# EAGLE design Athena-r0p1 (EAGLE 9.6.2)

## Sheet 1 of 5
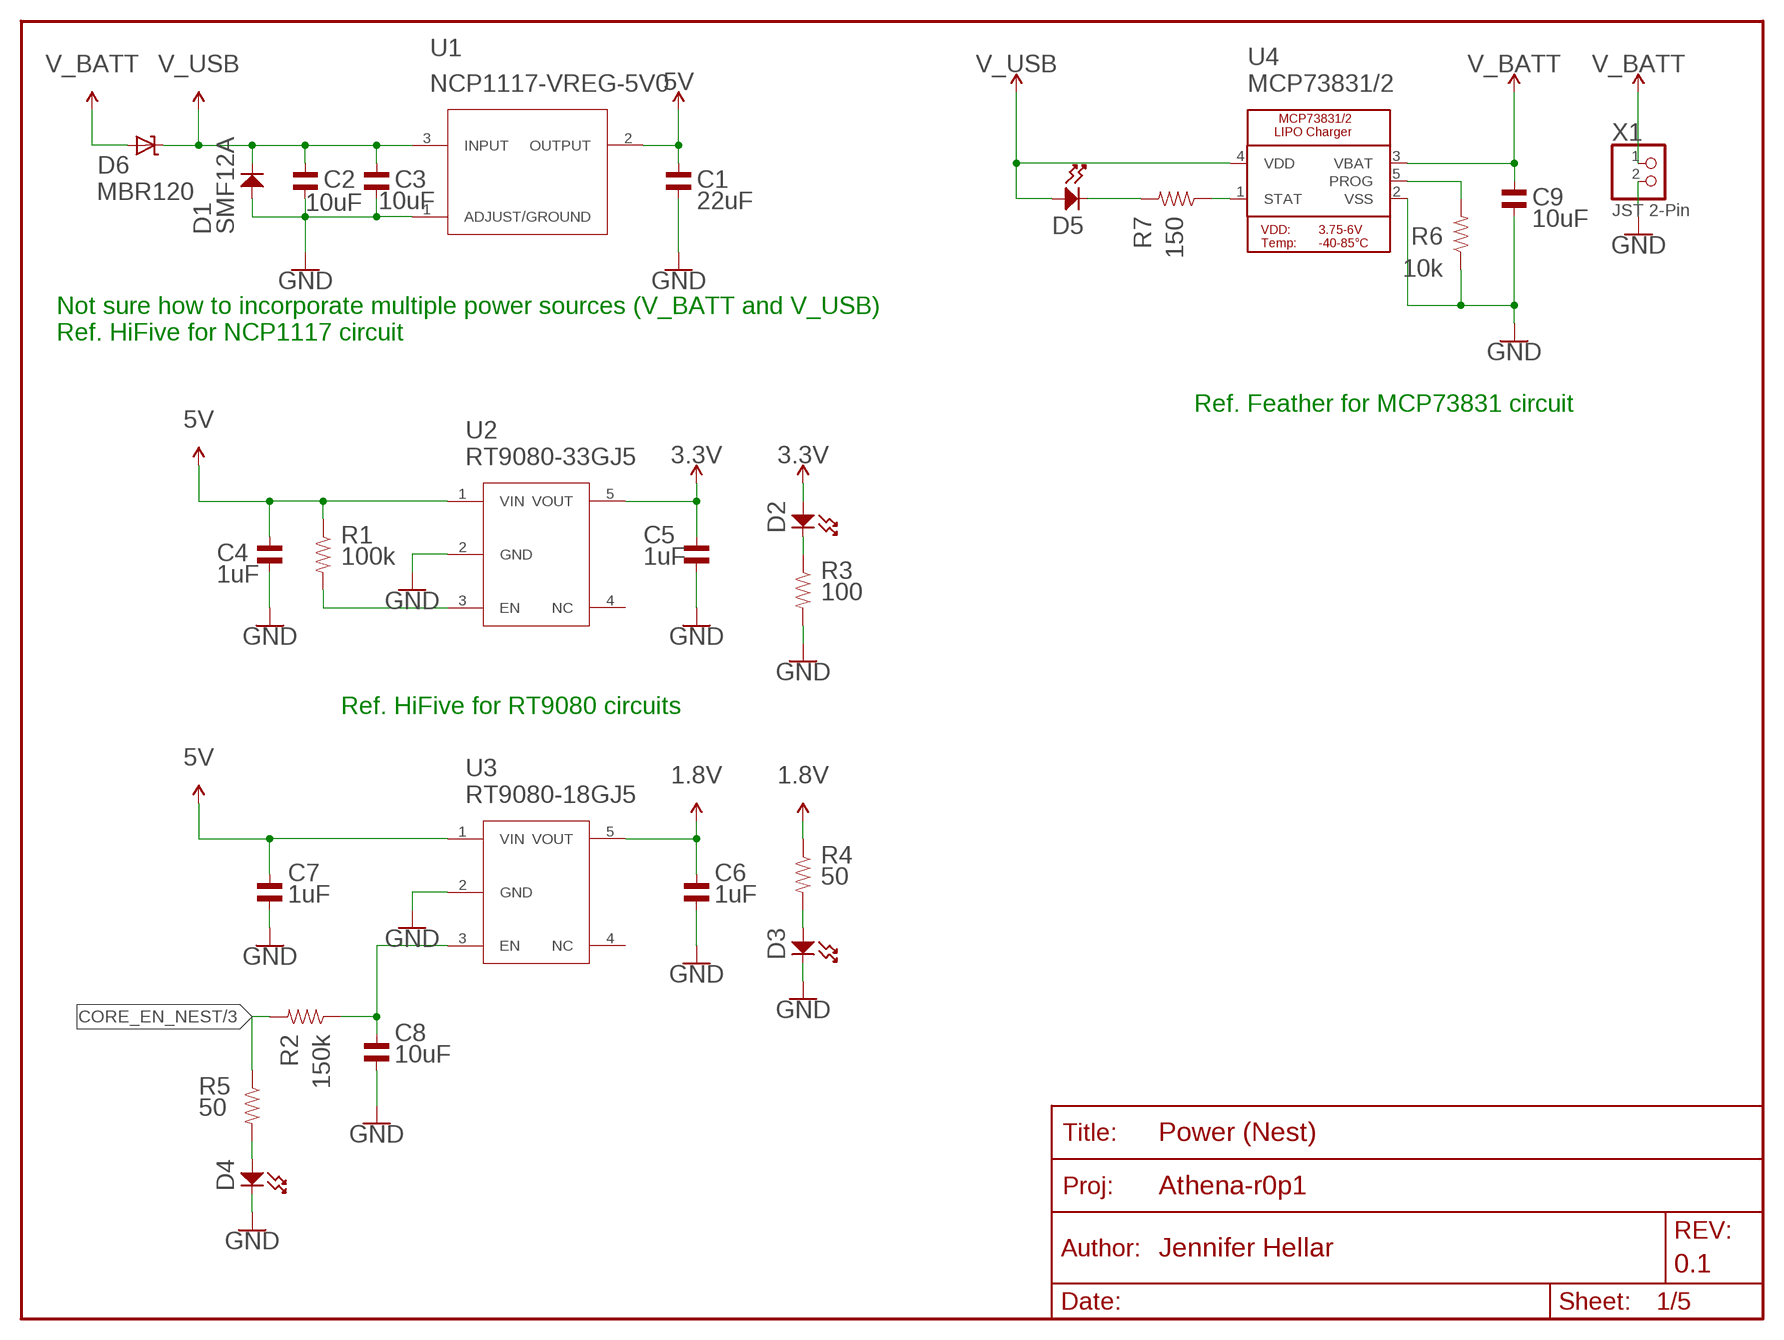
[diagram p0: schematic, sheet 1]

### Parts
C1  22uF  CAPACITOR_NP_0603  [C0603]
C2  10uF  CAPACITOR_NP_0603  [C0603]
C3  10uF  CAPACITOR_NP_0603  [C0603]
C4  1uF  CAPACITOR_NP_0603  [C0603]
C5  1uF  CAPACITOR_NP_0603  [C0603]
C6  1uF  CAPACITOR_NP_0603  [C0603]
C7  1uF  CAPACITOR_NP_0603  [C0603]
C8  10uF  CAPACITOR_NP_0603  [C0603]
C9  10uF  CAPACITOR_NP_0603  [C0603]
D1  SMF12A  [SMFSERIES_LTF]
D2  MF-LED-0603-GREEN  LED_SINGLE-0603-GREEN  [LED0603]
D3  MF-LED-0603-GREEN  LED_SINGLE-0603-GREEN  [LED0603]
D4  MF-LED-0603-GREEN  LED_SINGLE-0603-GREEN  [LED0603]
D5  MF-LED-0603-RED  LED_SINGLE-0603-RED  [LED0603]
D6  MBR120  DIODE-SCHOTTKYSOD-123  [SOD-123]
FRAME1  FRAME-LETTER  [SPARKFUN-AESTHETICS_CREATIVE_COMMONS]
R1  100k  RESISTOR_0603  [R0603]
R2  150k  RESISTOR_0603  [R0603]
R3  100  RESISTOR_0603  [R0603]
R4  50  RESISTOR_0603  [R0603]
R5  50  RESISTOR_0603  [R0603]
R6  10k  RESISTOR_0603  [R0603]
R7  150  RESISTOR_0603  [R0603]
U1  NCP1117-VREG-5V0  NCP1117LPST50T3G  [SOT223-3_ONS]
U2  RT9080-33GJ5  [TSOT23-5_ONS]
U3  RT9080-18GJ5  [TSOT23-5_ONS]
U4  MCP73831/2  IC_POWER_LIPO_MCP73831/2  [SOT23-5]
X1  JST 2-Pin  CONNECTORS_BATT_JST_PH_2PIN  [JSTPH2]

### Nets
1.8V: C6.P$1 R4.P$1 U3.5(VOUT) ; also sheet 3,4
3.3V: C5.P$1 D2.ANODE U2.5(VOUT) ; also sheet 2,3,4,5
5V: C1.P$1 C4.P$1 C7.P$1 R1.P$1 U1.2(OUTPUT) U2.1(VIN) U3.1(VIN) ; also sheet 2,3,5
CORE_EN_NEST: R2.P$2 R5.P$1 ; also sheet 3
GND: C1.P$2 C2.P$2 C3.P$2 C4.P$2 C5.P$2 C6.P$2 C7.P$2 C8.P$2 C9.P$2 D1.2(ANODE) D3.CATHODE D4.CATHODE R3.P$2 R6.P$1 U1.1(ADJUST/GROUND) U2.2(GND) U3.2(GND) U4.2(VSS) X1.2 ; also sheet 2,3,4,5
N$1: D3.ANODE R4.P$2
N$2: D2.CATHODE R3.P$1
N$3: R1.P$2 U2.3(EN)
N$4: C8.P$1 R2.P$1 U3.3(EN)
N$5: D4.ANODE R5.P$2
N$6: R7.P$1 U4.1(STAT)
N$7: R6.P$2 U4.5(PROG)
N$8: D5.CATHODE R7.P$2
V_BATT: C9.P$1 D6.A U4.3(VBAT) X1.1
V_USB: C2.P$1 C3.P$1 D1.1(CATHODE) D5.ANODE D6.C U1.3(INPUT) U4.4(VDD) ; also sheet 2
Unconnected: U2.4(NC) U3.4(NC)

### Notes on the sheet
- Not sure how to incorporate multiple power sources (V_BATT and V_USB)
  Ref. HiFive for NCP1117 circuit
- Ref. Feather for MCP73831 circuit
- Ref. HiFive for RT9080 circuits

## Sheet 2 of 5
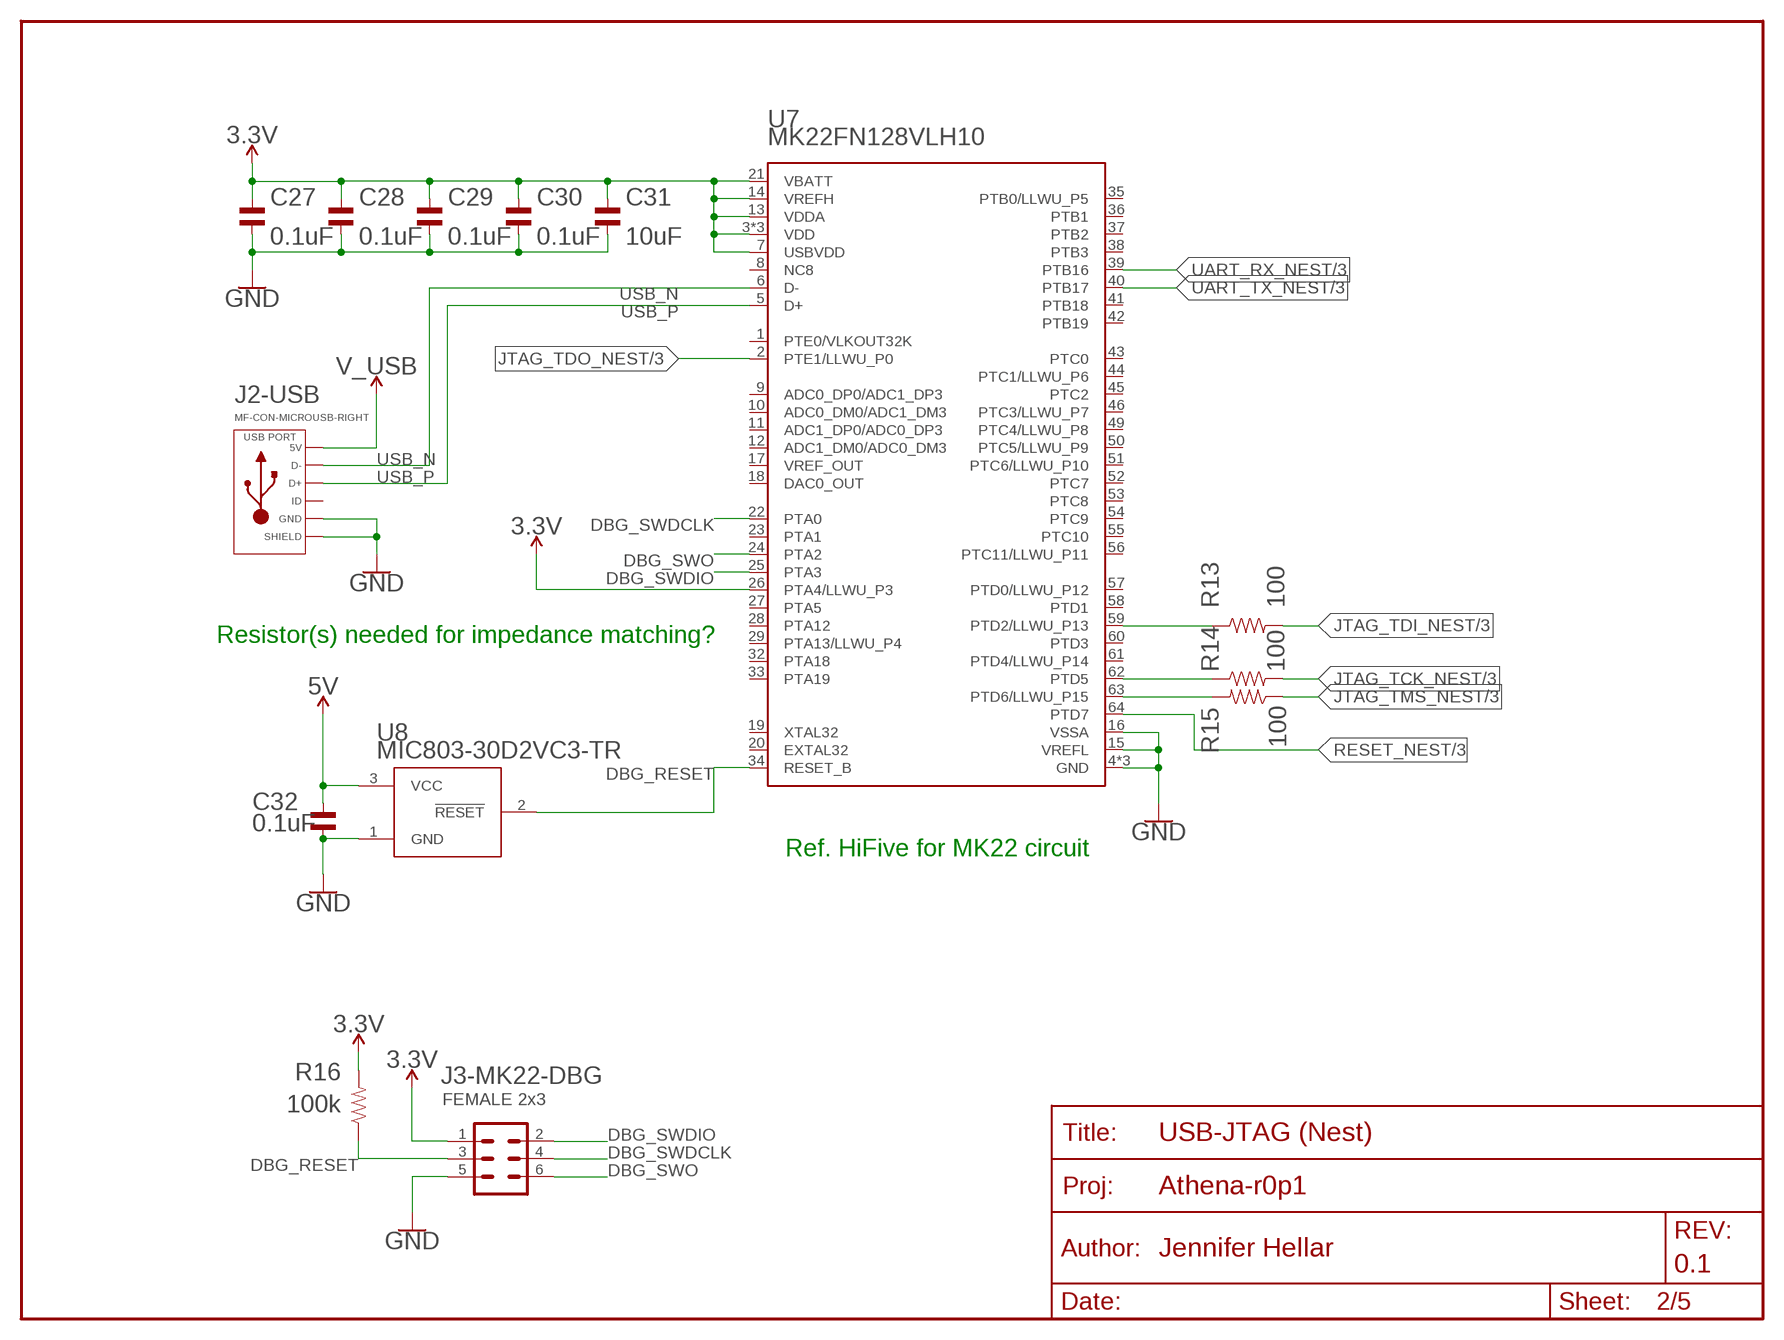
[diagram p1: schematic, sheet 2]

### Parts
C27  0.1uF  CAPACITOR_NP_0603  [C0603]
C28  0.1uF  CAPACITOR_NP_0603  [C0603]
C29  0.1uF  CAPACITOR_NP_0603  [C0603]
C30  0.1uF  CAPACITOR_NP_0603  [C0603]
C31  10uF  CAPACITOR_NP_0603  [C0603]
C32  0.1uF  CAPACITOR_NP_0603  [C0603]
FRAME3  FRAME-LETTER  [SPARKFUN-AESTHETICS_CREATIVE_COMMONS]
J2-USB  MF-CON-MICROUSB-RIGHT  USB_MICRO_RIGHT  [MICROUSB-RIGHT]
J3-MK22-DBG  FEMALE 2x3  CONN_03X2FEMALE  [2X3]
R13  100  RESISTOR_0603  [R0603]
R14  100  RESISTOR_0603  [R0603]
R15  100  RESISTOR_0603  [R0603]
R16  100k  RESISTOR_0603  [R0603]
U7  MK22FN128VLH10  IC_USB_JTAG_MK22FN128VLH10  [IC_USB_JTAG_LQFP-64]
U8  MIC803-30D2VC3-TR  [SC-70_C3_MCH]

### Nets
3.3V: C27.P$1 C28.P$1 C29.P$1 C30.P$1 C31.P$1 J3-MK22-DBG.1 R16.P$2 U7.3(VDD) U7.7(USBVDD) U7.13(VDDA) U7.14(VREFH) U7.21(VBATT) U7.26(PTA4/LLWU_P3) U7.30(VDD) U7.48(VDD) ; also sheet 1,3,4,5
5V: C32.P$1 U8.3(VCC) ; also sheet 1,3,5
DBG_RESET [USB]: J3-MK22-DBG.3 R16.P$1 U7.34(RESET_B) U8.2(!RESET)
DBG_SWDCLK: J3-MK22-DBG.4 U7.22(PTA0)
DBG_SWDIO: J3-MK22-DBG.2 U7.25(PTA3)
DBG_SWO: J3-MK22-DBG.6 U7.24(PTA2)
GND: C27.P$2 C28.P$2 C29.P$2 C30.P$2 C31.P$2 C32.P$2 J2-USB.5(GND) J2-USB.S1(SLD) J2-USB.S2(SLD) J2-USB.S3(SLD) J2-USB.S4(SLD) J2-USB.S5(SLD) J2-USB.S6(SLD) J3-MK22-DBG.5 U7.4(GND) U7.15(VREFL) U7.16(VSSA) U7.31(GND) U7.47(GND) U8.1(GND) ; also sheet 1,3,4,5
JTAG_TCK_NEST: R14.P$2 ; also sheet 3
JTAG_TDI_NEST: R13.P$2 ; also sheet 3
JTAG_TDO_NEST: U7.2(PTE1/LLWU_P0) ; also sheet 3
JTAG_TMS_NEST: R15.P$1 ; also sheet 3
N$12: R13.P$1 U7.59(PTD2/LLWU_P13)
N$14: R14.P$1 U7.62(PTD5)
N$16: R15.P$2 U7.63(PTD6/LLWU_P15)
RESET_NEST: U7.64(PTD7) ; also sheet 3
UART_RX_NEST: U7.39(PTB16) ; also sheet 3
UART_TX_NEST: U7.40(PTB17) ; also sheet 3
USB_N [USB]: J2-USB.2(D-) U7.6(D-)
USB_P [USB]: J2-USB.3(D+) U7.5(D+)
V_USB: J2-USB.1(5V) ; also sheet 1
Unconnected: J2-USB.4(ID) U7.1(PTE0/VLKOUT32K) U7.8(NC8) U7.9(ADC0_DP0/ADC1_DP3) U7.10(ADC0_DM0/ADC1_DM3) U7.11(ADC1_DP0/ADC0_DP3) U7.12(ADC1_DM0/ADC0_DM3) U7.17(VREF_OUT) U7.18(DAC0_OUT) U7.19(XTAL32) U7.20(EXTAL32) U7.23(PTA1) U7.27(PTA5) U7.28(PTA12) U7.29(PTA13/LLWU_P4) U7.32(PTA18) U7.33(PTA19) U7.35(PTB0/LLWU_P5) U7.36(PTB1) U7.37(PTB2) U7.38(PTB3) U7.41(PTB18) U7.42(PTB19) U7.43(PTC0) U7.44(PTC1/LLWU_P6) U7.45(PTC2) U7.46(PTC3/LLWU_P7) U7.49(PTC4/LLWU_P8) U7.50(PTC5/LLWU_P9) U7.51(PTC6/LLWU_P10) U7.52(PTC7) U7.53(PTC8) U7.54(PTC9) U7.55(PTC10) U7.56(PTC11/LLWU_P11) U7.57(PTD0/LLWU_P12) U7.58(PTD1) U7.60(PTD3) U7.61(PTD4/LLWU_P14)

### Notes on the sheet
- Resistor(s) needed for impedance matching?
- Ref. HiFive for MK22 circuit

## Sheet 3 of 5
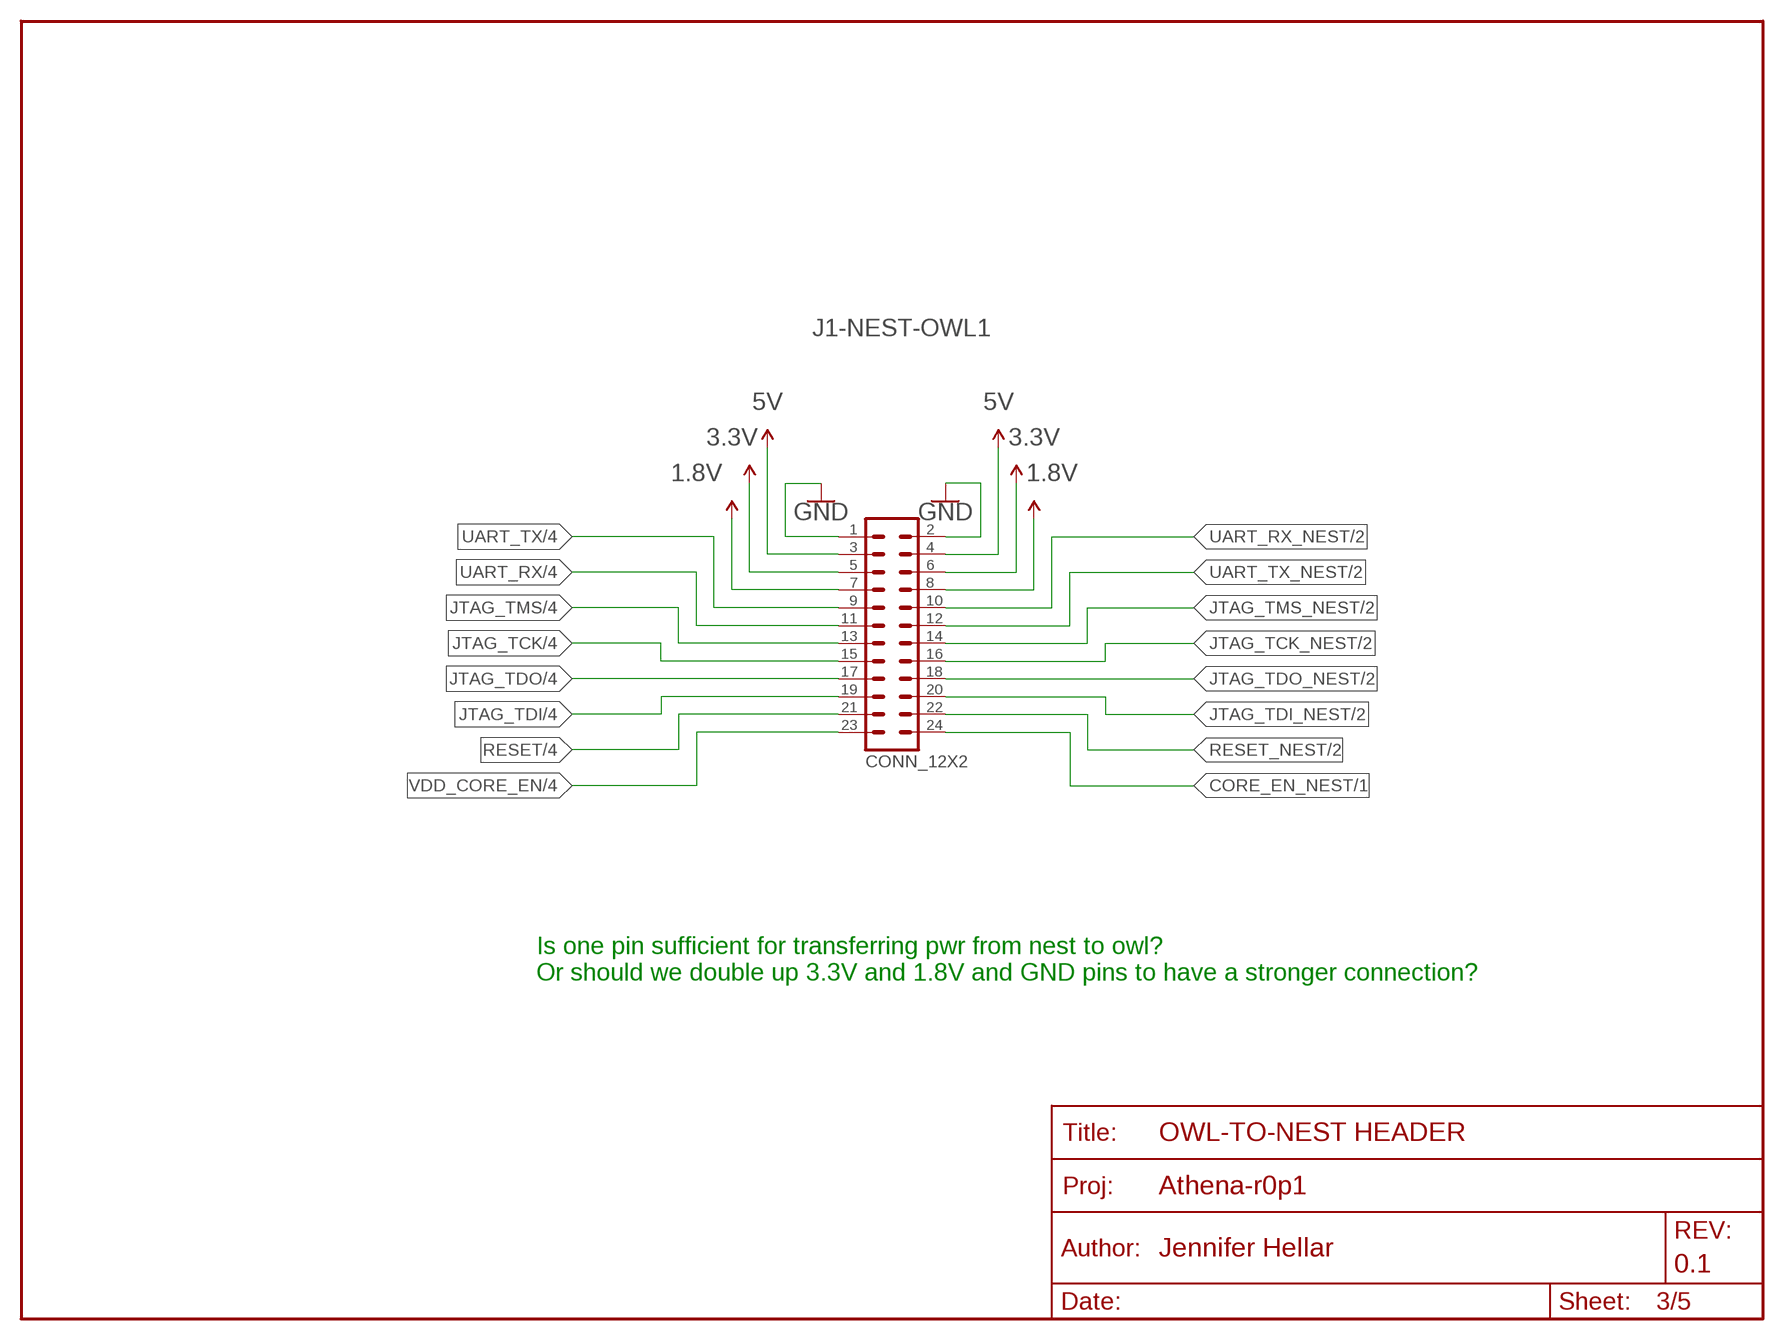
[diagram p2: schematic, sheet 3]

### Parts
FRAME5  FRAME-LETTER  [SPARKFUN-AESTHETICS_CREATIVE_COMMONS]
J1-NEST-OWL1  CONN_12X2  [2X12]

### Nets
1.8V: J1-NEST-OWL1.7 J1-NEST-OWL1.8 ; also sheet 1,4
3.3V: J1-NEST-OWL1.5 J1-NEST-OWL1.6 ; also sheet 1,2,4,5
5V: J1-NEST-OWL1.3 J1-NEST-OWL1.4 ; also sheet 1,2,5
CORE_EN_NEST: J1-NEST-OWL1.24 ; also sheet 1
GND: J1-NEST-OWL1.1 J1-NEST-OWL1.2 ; also sheet 1,2,4,5
JTAG_TCK: J1-NEST-OWL1.15 ; also sheet 4
JTAG_TCK_NEST: J1-NEST-OWL1.16 ; also sheet 2
JTAG_TDI: J1-NEST-OWL1.19 ; also sheet 4
JTAG_TDI_NEST: J1-NEST-OWL1.20 ; also sheet 2
JTAG_TDO: J1-NEST-OWL1.17 ; also sheet 4
JTAG_TDO_NEST: J1-NEST-OWL1.18 ; also sheet 2
JTAG_TMS: J1-NEST-OWL1.13 ; also sheet 4
JTAG_TMS_NEST: J1-NEST-OWL1.14 ; also sheet 2
RESET: J1-NEST-OWL1.21 ; also sheet 4,5
RESET_NEST: J1-NEST-OWL1.22 ; also sheet 2
UART_RX: J1-NEST-OWL1.11 ; also sheet 4
UART_RX_NEST: J1-NEST-OWL1.10 ; also sheet 2
UART_TX: J1-NEST-OWL1.9 ; also sheet 4
UART_TX_NEST: J1-NEST-OWL1.12 ; also sheet 2
VDD_CORE_EN: J1-NEST-OWL1.23 ; also sheet 4,5

### Notes on the sheet
- Is one pin sufficient for transferring pwr from nest to owl?  
  Or should we double up 3.3V and 1.8V and GND pins to have a stronger connection?

## Sheet 4 of 5
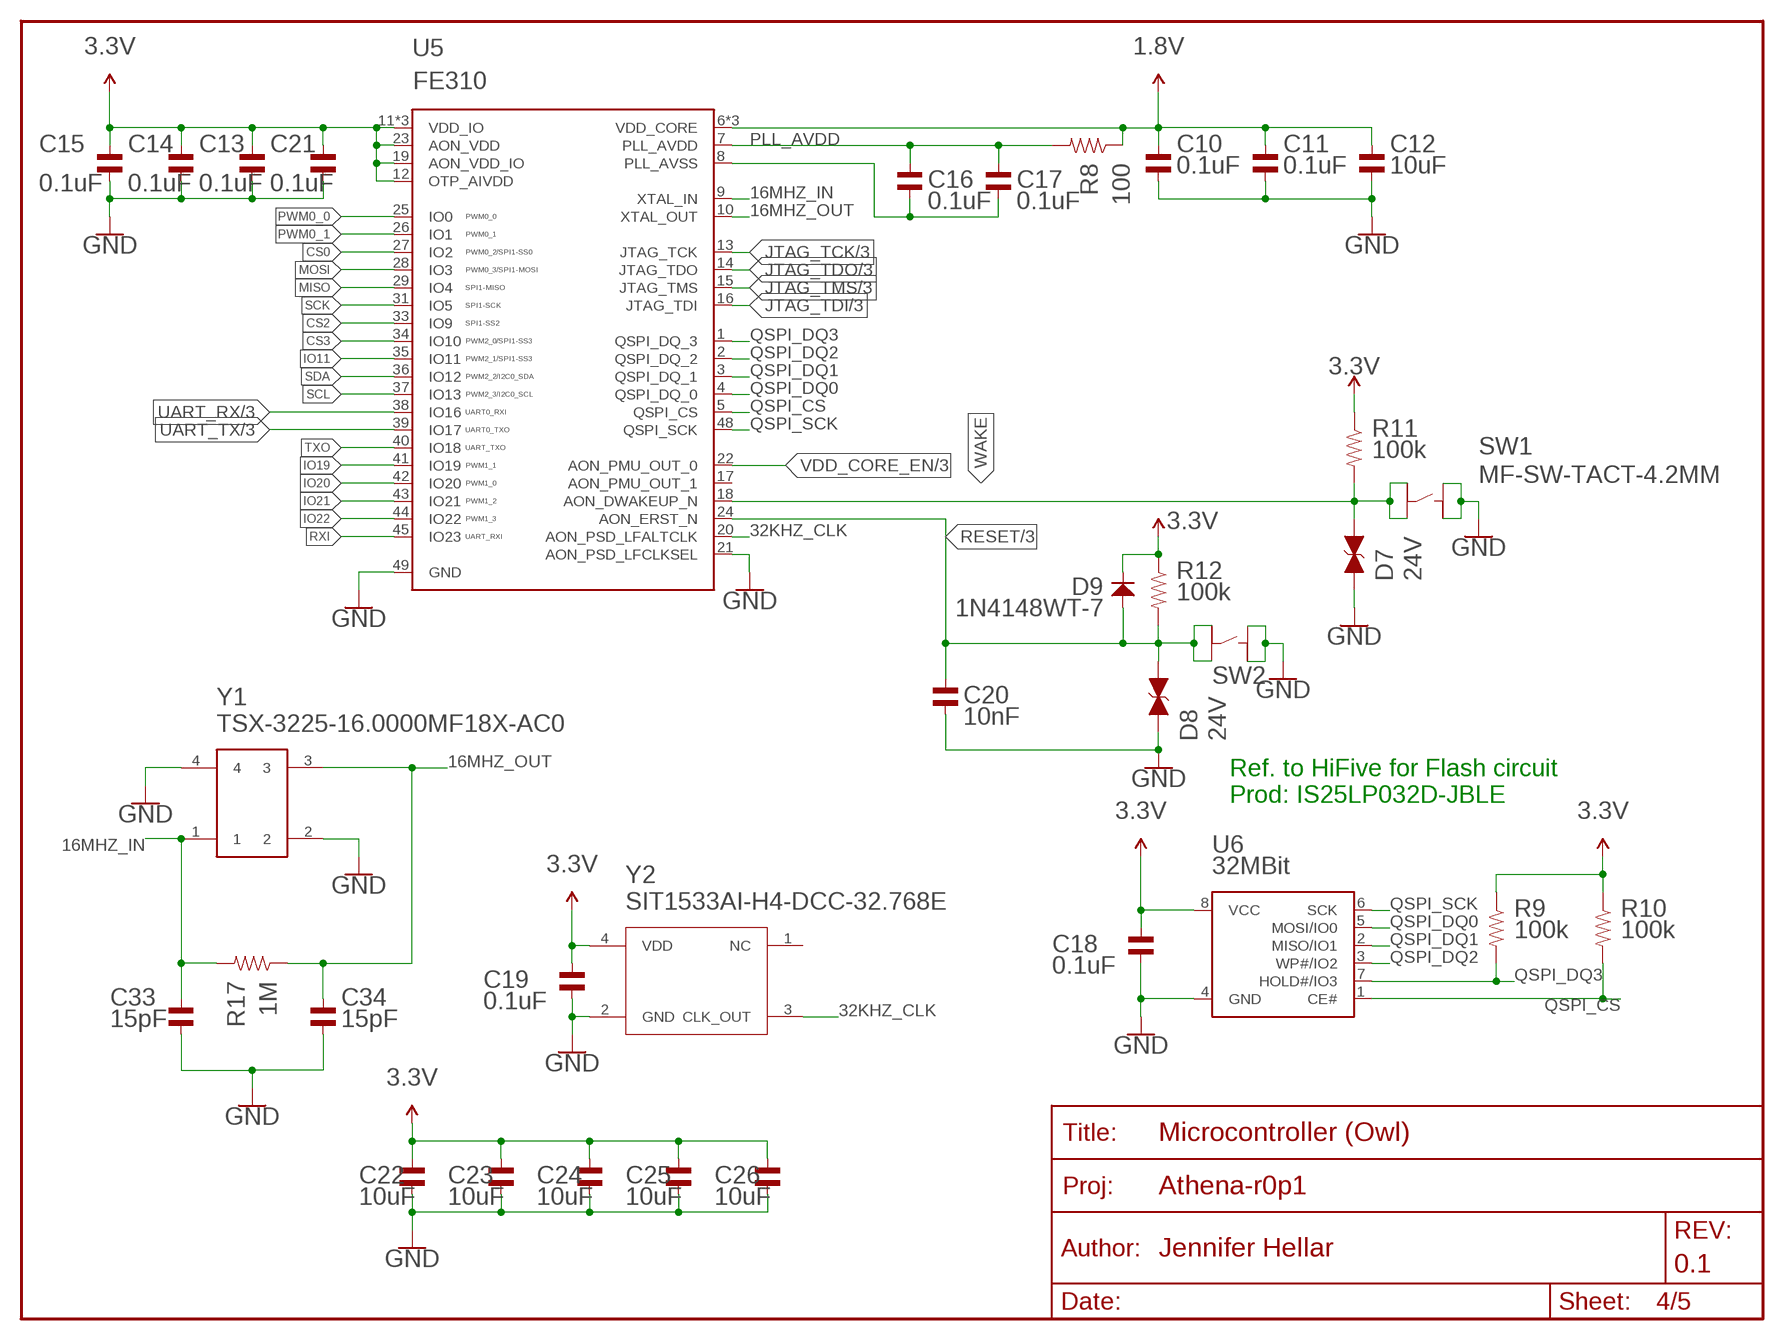
[diagram p3: schematic, sheet 4]

### Parts
C10  0.1uF  CAPACITOR_NP_0603  [C0603]
C11  0.1uF  CAPACITOR_NP_0603  [C0603]
C12  10uF  CAPACITOR_NP_0603  [C0603]
C13  0.1uF  CAPACITOR_NP_0603  [C0603]
C14  0.1uF  CAPACITOR_NP_0603  [C0603]
C15  0.1uF  CAPACITOR_NP_0603  [C0603]
C16  0.1uF  CAPACITOR_NP_0603  [C0603]
C17  0.1uF  CAPACITOR_NP_0603  [C0603]
C18  0.1uF  CAPACITOR_NP_0603  [C0603]
C19  0.1uF  CAPACITOR_NP_0603  [C0603]
C20  10nF  CAPACITOR_NP_0603  [C0603]
C21  0.1uF  CAPACITOR_NP_0603  [C0603]
C22  10uF  CAPACITOR_NP_0603  [C0603]
C23  10uF  CAPACITOR_NP_0603  [C0603]
C24  10uF  CAPACITOR_NP_0603  [C0603]
C25  10uF  CAPACITOR_NP_0603  [C0603]
C26  10uF  CAPACITOR_NP_0603  [C0603]
C33  15pF  CAPACITOR_NP_0603  [C0603]
C34  15pF  CAPACITOR_NP_0603  [C0603]
D7  24V  SPARKFUN-DISCRETESEMI_DIODE_TVS  [SPARKFUN-DISCRETESEMI_0603]
D8  24V  SPARKFUN-DISCRETESEMI_DIODE_TVS  [SPARKFUN-DISCRETESEMI_0603]
D9  1N4148WT-7  [SOD-523]
FRAME2  FRAME-LETTER  [SPARKFUN-AESTHETICS_CREATIVE_COMMONS]
R8  100  RESISTOR_0603  [R0603]
R9  100k  RESISTOR_0603  [R0603]
R10  100k  RESISTOR_0603  [R0603]
R11  100k  RESISTOR_0603  [R0603]
R12  100k  RESISTOR_0603  [R0603]
R17  1M  RESISTOR_0603  [R0603]
SW1  MF-SW-TACT-4.2MM  TACT_4.2MM  [TACT4.2MM]
SW2  MF-SW-TACT-4.2MM  TACT_4.2MM  [TACT4.2MM]
U5  FE310  IC_MCU_SIFIVE_FE310  [MCU_QFN-48-.4MMPITCH]
U6  32MBit  IC_MEMORY_QSPI32MBIT  [IC-MEMORY_SO08]
Y1  TSX-3225-16.0000MF18X-AC0  [TSX-3225]
Y2  SIT1533AI-H4-DCC-32.768E  [XTAL4_SIT1533_SIT]

### Nets
1.8V: C10.P$1 C11.P$1 C12.P$1 R8.P$1 U5.6(VDD_CORE) U5.30(VDD_CORE) U5.46(VDD_CORE) ; also sheet 1,3
3.3V: C13.P$1 C14.P$1 C15.P$1 C18.P$1 C19.P$1 C21.P$1 C22.P$1 C23.P$1 C24.P$1 C25.P$1 C26.P$1 D9.K(CATHODE) R9.P$1 R10.P$1 R11.P$1 R12.P$1 U5.11(VDD_IO) U5.12(OTP_AIVDD) U5.19(AON_VDD_IO) U5.23(AON_VDD) U5.32(VDD_IO) U5.47(VDD_IO) U6.8(VCC) Y2.4(VDD) ; also sheet 1,2,3,5
16MHZ_IN: C33.P$1 R17.P$2 U5.9(XTAL_IN) Y1.1
16MHZ_OUT: C34.P$1 R17.P$1 U5.10(XTAL_OUT) Y1.3
32KHZ_CLK: U5.20(AON_PSD_LFALTCLK) Y2.3(CLK_OUT)
CS0: U5.27(IO2) ; also sheet 5
CS2: U5.33(IO9) ; also sheet 5
CS3: U5.34(IO10) ; also sheet 5
GND: C10.P$2 C11.P$2 C12.P$2 C13.P$2 C14.P$2 C15.P$2 C18.P$2 C19.P$2 C20.P$2 C21.P$2 C22.P$2 C23.P$2 C24.P$2 C25.P$2 C26.P$2 C33.P$2 C34.P$2 D7.1(A) D8.1(A) SW1.P$1 SW1.P$2 SW2.P$1 SW2.P$2 U5.21(AON_PSD_LFCLKSEL) U5.49(GND) U6.4(GND) Y1.2 Y1.4 Y2.2(GND) ; also sheet 1,2,3,5
IO11: U5.35(IO11) ; also sheet 5
IO19: U5.41(IO19) ; also sheet 5
IO20: U5.42(IO20) ; also sheet 5
IO21: U5.43(IO21) ; also sheet 5
IO22: U5.44(IO22) ; also sheet 5
JTAG_TCK: U5.13(JTAG_TCK) ; also sheet 3
JTAG_TDI: U5.16(JTAG_TDI) ; also sheet 3
JTAG_TDO: U5.14(JTAG_TDO) ; also sheet 3
JTAG_TMS: U5.15(JTAG_TMS) ; also sheet 3
MISO: U5.29(IO4) ; also sheet 5
MOSI: U5.28(IO3) ; also sheet 5
N$10: C16.P$2 C17.P$2 U5.8(PLL_AVSS)
PLL_AVDD: C16.P$1 C17.P$1 R8.P$2 U5.7(PLL_AVDD)
PWM0_0: U5.25(IO0) ; also sheet 5
PWM0_1: U5.26(IO1) ; also sheet 5
QSPI_CS [QSPI]: R10.P$2 U5.5(QSPI_CS) U6.1(CE#)
QSPI_DQ0 [QSPI]: U5.4(QSPI_DQ_0) U6.5(MOSI/IO0)
QSPI_DQ1 [QSPI]: U5.3(QSPI_DQ_1) U6.2(MISO/IO1)
QSPI_DQ2 [QSPI]: U5.2(QSPI_DQ_2) U6.3(WP#/IO2)
QSPI_DQ3 [QSPI]: R9.P$2 U5.1(QSPI_DQ_3) U6.7(HOLD#/IO3)
QSPI_SCK [QSPI]: U5.48(QSPI_SCK) U6.6(SCK)
RESET: C20.P$1 D8.2(C) D9.A(ANODE) R12.P$2 SW2.P$3 SW2.P$4 U5.24(AON_ERST_N) ; also sheet 3,5
RXI: U5.45(IO23) ; also sheet 5
SCK: U5.31(IO5) ; also sheet 5
SCL: U5.37(IO13) ; also sheet 5
SDA: U5.36(IO12) ; also sheet 5
TXO: U5.40(IO18) ; also sheet 5
UART_RX: U5.38(IO16) ; also sheet 3
UART_TX: U5.39(IO17) ; also sheet 3
VDD_CORE_EN: U5.22(AON_PMU_OUT_0) ; also sheet 3,5
WAKE: D7.2(C) R11.P$2 SW1.P$3 SW1.P$4 U5.18(AON_DWAKEUP_N) ; also sheet 5
Unconnected: U5.17(AON_PMU_OUT_1) Y2.1(NC)

### Notes on the sheet
- Ref. to HiFive for Flash circuit
  Prod: IS25LP032D-JBLE

## Sheet 5 of 5
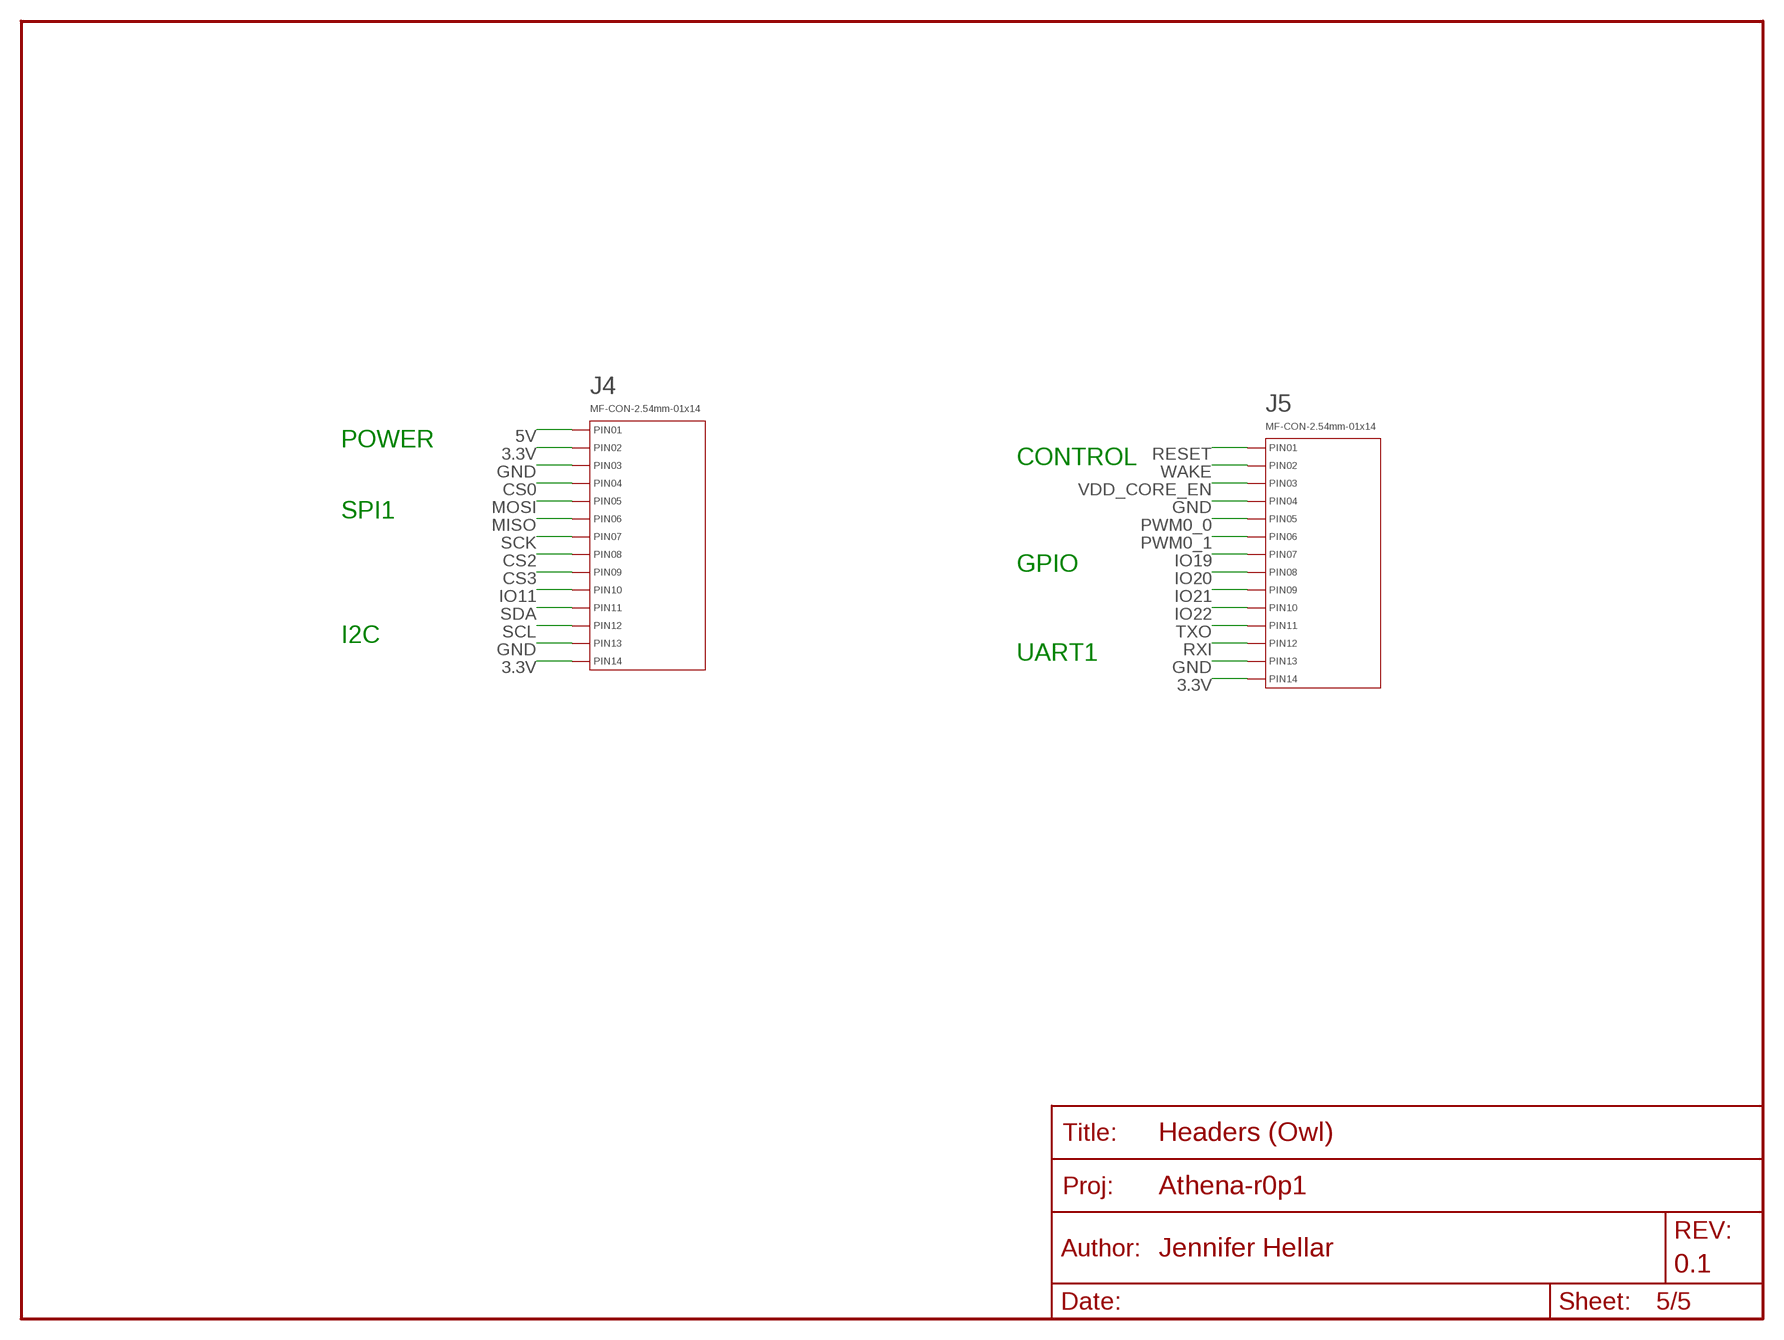
[diagram p4: schematic, sheet 5]

### Parts
FRAME4  FRAME-LETTER  [SPARKFUN-AESTHETICS_CREATIVE_COMMONS]
J4  MF-CON-2.54mm-01x14  CON_01X14_PTH_2.54MM  [PTH_2.54MM_01X14]
J5  MF-CON-2.54mm-01x14  CON_01X14_PTH_2.54MM  [PTH_2.54MM_01X14]

### Nets
3.3V: J4.P$2(PIN2) J4.P$14(PIN14) J5.P$14(PIN14) ; also sheet 1,2,3,4
5V: J4.P$1(PIN1) ; also sheet 1,2,3
CS0: J4.P$4(PIN4) ; also sheet 4
CS2: J4.P$8(PIN8) ; also sheet 4
CS3: J4.P$9(PIN9) ; also sheet 4
GND: J4.P$3(PIN3) J4.P$13(PIN13) J5.P$4(PIN4) J5.P$13(PIN13) ; also sheet 1,2,3,4
IO11: J4.P$10(PIN10) ; also sheet 4
IO19: J5.P$7(PIN7) ; also sheet 4
IO20: J5.P$8(PIN8) ; also sheet 4
IO21: J5.P$9(PIN9) ; also sheet 4
IO22: J5.P$10(PIN10) ; also sheet 4
MISO: J4.P$6(PIN6) ; also sheet 4
MOSI: J4.P$5(PIN5) ; also sheet 4
PWM0_0: J5.P$5(PIN5) ; also sheet 4
PWM0_1: J5.P$6(PIN6) ; also sheet 4
RESET: J5.P$1(PIN1) ; also sheet 3,4
RXI: J5.P$12(PIN12) ; also sheet 4
SCK: J4.P$7(PIN7) ; also sheet 4
SCL: J4.P$12(PIN12) ; also sheet 4
SDA: J4.P$11(PIN11) ; also sheet 4
TXO: J5.P$11(PIN11) ; also sheet 4
VDD_CORE_EN: J5.P$3(PIN3) ; also sheet 3,4
WAKE: J5.P$2(PIN2) ; also sheet 4

### Notes on the sheet
- POWER
- CONTROL
- SPI1
- GPIO
- I2C
- UART1

## Library data of the parts
C1-C34 = MF_Passives:CAPACITOR_NP: Library: MF_Passives Description: Device for Non-Polarized Capacitors. Manufacture part number (MPN) can be added via Attributes. Check https://factory.macrofab.com/parts for the house parts list.; POPULATE: 1
D1 = Athena-r0p1:SMF12A; BUILT_BY: EMA_UL_Team; MANUFACTURER_PART_NUMBER: SMF12A; SOURCELIBRARY: LittleFuse_2015-04-13; VENDOR: Littelfuse Inc
D2-D4 = MF_LEDs:LED_SINGLE: Library: MF_LEDs Description: Device for Single LED Packages. Manufacture part number (MFG#) can be added via Attributes.; HOUSEPART: YES; MPN: MF-LED-0603-GREEN; POPULATE: 1; URL: https://factory.macrofab.com/part/MF-LED-0603-GREEN
D5 = MF_LEDs:LED_SINGLE: Library: MF_LEDs Description: Device for Single LED Packages. Manufacture part number (MFG#) can be added via Attributes.; HOUSEPART: YES; MPN: MF-LED-0603-RED; POPULATE: 1; URL: https://factory.macrofab.com/part/MF-LED-0603-RED
D6 = Athena-r0p1:DIODE-SCHOTTKY
D7 D8 = SparkFun RED-V RedBoard:SPARKFUN-DISCRETESEMI_DIODE_TVS; PROD_ID: DIO-14502
D9 = Athena-r0p1:1N4148WT-7; BUILT_BY: EMA_Anthony; COPYRIGHT: Copyright (C) 2016 Accelerated Designs. All rights reserved; MANUFACTURER_PART_NUMBER: 1N4148WT-7; SOURCELIBRARY: Diodes_Inc_2018-12-15; VENDOR: Diodes Inc
FRAME1 = Athena-r0p1:FRAME-LETTER: Schematic Frame - Letter Standard 8.5x11 US Letter frame; DESIGNER: Jennifer Hellar; REV: 0.1; SHEETNM: Power (Nest); VERSION: v01
FRAME2 = Athena-r0p1:FRAME-LETTER: Schematic Frame - Letter Standard 8.5x11 US Letter frame; DESIGNER: Jennifer Hellar; REV: 0.1; SHEETNM: Microcontroller (Owl); VERSION: v01
FRAME3 = Athena-r0p1:FRAME-LETTER: Schematic Frame - Letter Standard 8.5x11 US Letter frame; DESIGNER: Jennifer Hellar; REV: 0.1; SHEETNM: USB-JTAG (Nest); VERSION: v01
FRAME4 = Athena-r0p1:FRAME-LETTER: Schematic Frame - Letter Standard 8.5x11 US Letter frame; DESIGNER: Jennifer Hellar; REV: 0.1; SHEETNM: Headers (Owl); VERSION: v01
FRAME5 = Athena-r0p1:FRAME-LETTER: Schematic Frame - Letter Standard 8.5x11 US Letter frame; DESIGNER: Jennifer Hellar; REV: 0.1; SHEETNM: OWL-TO-NEST HEADER; VERSION: v01
J1-NEST-OWL1 = SparkFun-Connectors:CONN_12X2: Multi connection point. Often used as Generic Header-pin footprint for 0.1 inch spaced/style header connections On any of the 0.1 inch spaced packages, you can populate with these: Break Away Headers - Straight <https://www.sparkfun.com/products/116> (PRT-00116) Break Away Male Headers - Right Angle <https://www.sparkfun.com/products/553> (PRT-00553) Female Headers <https://www.sparkfun.com/products/115> (PRT-00115) Break Away Headers - Machine Pin <https://www.sparkfun.com/products/117> (PRT-00117) Break Away Female Headers - Swiss Machine Pin <https://www.sparkfun.com/products/743> (PRT-00743)
J2-USB = MF_Connectors:USB: Library: MF_Connectors Description: 5 Pin USB Connectors. SLD is the shield connection. Usually tied to ground through a small ferrite bead.; HOUSEPART: YES; MPN: MF-CON-MICROUSB-RIGHT; POPULATE: 1; URL: https://factory.macrofab.com/part/MF-CON-MICROUSB-RIGHT
J3-MK22-DBG = SparkFun-Connectors:CONN_03X2: Multi connection point. Often used as Generic Header-pin footprint for 0.1 inch spaced/style header connections You can populate with any combo of single row headers, but if you'd like an exact match, check these: Header - 2x3 (Male, 0.1") <https://www.sparkfun.com/products/12807> (PRT-12807) Header - 2x3 (Female, 0.1") <https://www.sparkfun.com/products/13010> (PRT-13010) 2x3 Pin Shrouded Header <https://www.sparkfun.com/products/10877> (PRT-10877) On any of the 0.1 inch spaced packages, you can populate with these: Break Away Headers - Straight <https://www.sparkfun.com/products/116> (PRT-00116) Break Away Male Headers - Right Angle <https://www.sparkfun.com/products/553> (PRT-00553) Female Headers <https://www.sparkfun.com/products/115> (PRT-00115) Break Away Headers - Machine Pin <https://www.sparkfun.com/products/117> (PRT-00117) Break Away Female Headers - Swiss Machine Pin <https://www.sparkfun.com/products/743> (PRT-00743) Special note: the shrouded connector mates well with our 3x2 ribbon cables: Ribbon Crimp Connector - 6-pin (2x3, Female) <https://www.sparkfun.com/products/10651> (PRT-10651) Ribbon Cable - 6 wire (15ft) <https://www.sparkfun.com/products/10646> (PRT-10646); PROD_ID: CONN-11566
J4 J5 = MF_Connectors:CON_01X14: Library: MF_Connectors Description: Header Connector with 14 Positions and 01 Rows. Use the LABEL Attribute to label the pin on the schematic and PCB. You can remove the attributes on the PCB by using the SMASH function on the part and then deleting the text.; HOUSEPART: YES; MPN: MF-CON-2.54mm-01x14; POPULATE: 1; URL: https://factory.macrofab.com/part/MF-CON-2.54mm-01x14
R1-R17 = MF_Passives:RESISTOR: Library: MF_Passives Description: Device for Resistors. Manufacture part number (MPN), Voltage, Tolerance, and Wattage Rating can be added via Attributes. Check https://factory.macrofab.com/parts for the house parts list.; POPULATE: 1
SW1 SW2 = MF_Switches:TACT: Library: MF_Switches Description: Device for Tact Switches. Manufacture part number (MFG#) can be added via Attributes.; HOUSEPART: YES; MPN: MF-SW-TACT-4.2MM; POPULATE: 1; URL: https://factory.macrofab.com/part/MF-SW-TACT-4.2MM
U1 = Athena-r0p1:NCP1117LPST50T3G; COPYRIGHT: Copyright (C) 2016 Accelerated Designs. All rights reserved; MANUFACTURER_PART_NUMBER: NCP1117LPST50T3G; SOURCELIBRARY: ONSemi_2017-12-12_4; VENDOR: ON Semiconductor
U2 = Athena-r0p1:RT9080-33GJ5
U3 = Athena-r0p1:RT9080-18GJ5
U4 = Athena-r0p1:IC_POWER_LIPO_MCP73831/2: MCP73831/2 LIPO Charger VDD: 3.75 - 6V Temp -40 - 85°C Programmable Charge Rate: 15-500mA NOTE: STAT is a tri-state logic output on the MCP73831 and an open-drain output on the MCP73832. SOT23-5 with 4.2V output and tri-state logic on STAT = MCP73831T-2ACI/OT
U5 = Athena-r0p1:IC_MCU_SIFIVE_FE310: SiFive FE310 - RISC-V MCU The FE310-G002 is the second Freedom E300 SoC. The FE310-G002 is built around the E31 Core Complex instantiated in the Freedom E300 platform.; PROD_ID: IC-14494
U6 = Athena-r0p1:IC_MEMORY_QSPI32MBIT: Integrated Silicon Solution Inc. IS25LP032D The IS25LP032D Serial Flash memory offers a versatile storage solution with high flexibility and performance in a simplified pin count package. ISSI’s “Industry Standard Serial Interface” Flash is for systems that require limited space, a low pin count, and low power consumption. The device is accessed through a 4-wire SPI Interface consisting of a Serial Data Input (SI), Serial Data Output (SO), Serial Clock (SCK), and Chip Enable (CE#) pins, which can also be configured to serve as multi-I/O (see pin descriptions). Datasheet <http://www.issi.com/WW/pdf/25LP-WP032D.pdf>; PROD_ID: IC-14501
U7 = Athena-r0p1:IC_USB_JTAG_MK22FN128VLH10: The Kinetis K22 product family members are optimized for costsensitive applications requiring low-power, USB connectivity, high peripheral integration and processing efficiency with a floating-point unit. These devices share the comprehensive enablement and scalability of the Kinetis family.; PROD_ID: IC-14611
U8 = Athena-r0p1:MIC803-30D2VC3-TR; BUILT_BY: EMA_Jessica; COPYRIGHT: Copyright (C) 2018 Accelerated Designs. All rights reserved; MANUFACTURER_PART_NUMBER: MIC803-30D2VC3-TR; SOURCELIBRARY: Microchip_2019-08-23_3; VENDOR: Microchip
X1 = Athena-r0p1:CONNECTORS_BATT_JST_PH_2PIN: JST 2-Pin Right-Angle Connector PH-Series - 4UConnector: 17311 SH-Series - 4UConnector: 07278
Y1 = Athena-r0p1:TSX-3225-16.0000MF18X-AC0
Y2 = Athena-r0p1:SIT1533AI-H4-DCC-32.768E; BUILT_BY: EMA_Justin; COPYRIGHT: Copyright (C) 2018 Accelerated Designs. All rights reserved; MANUFACTURER_PART_NUMBER: SIT1533AI-H4-DCC-32.768E; SOURCELIBRARY: SiTime_2019-03-28_19; VENDOR: SiTime

## Board
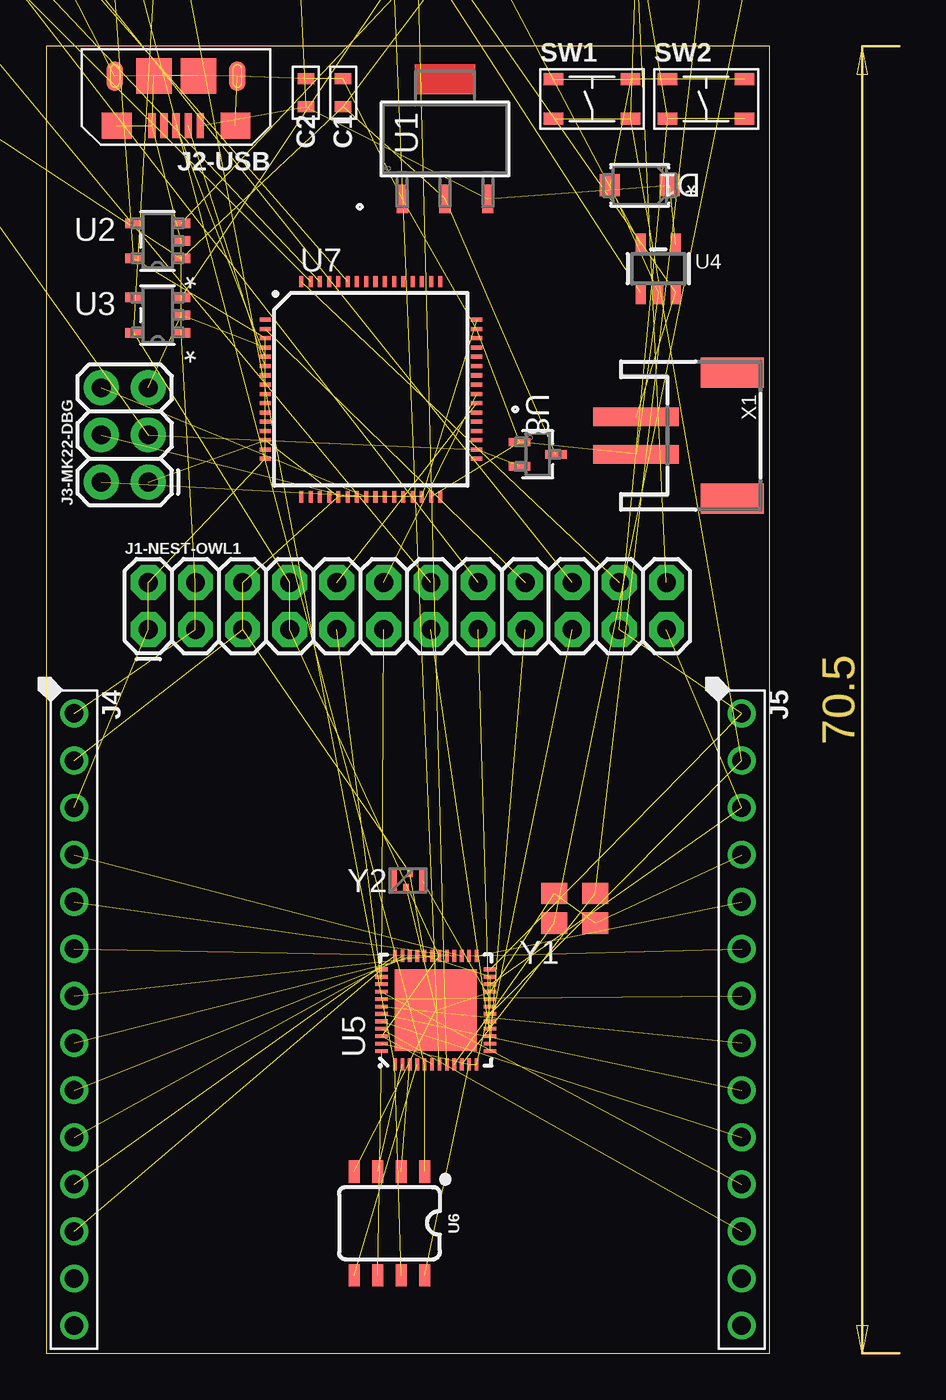
[diagram p5: board, top side]
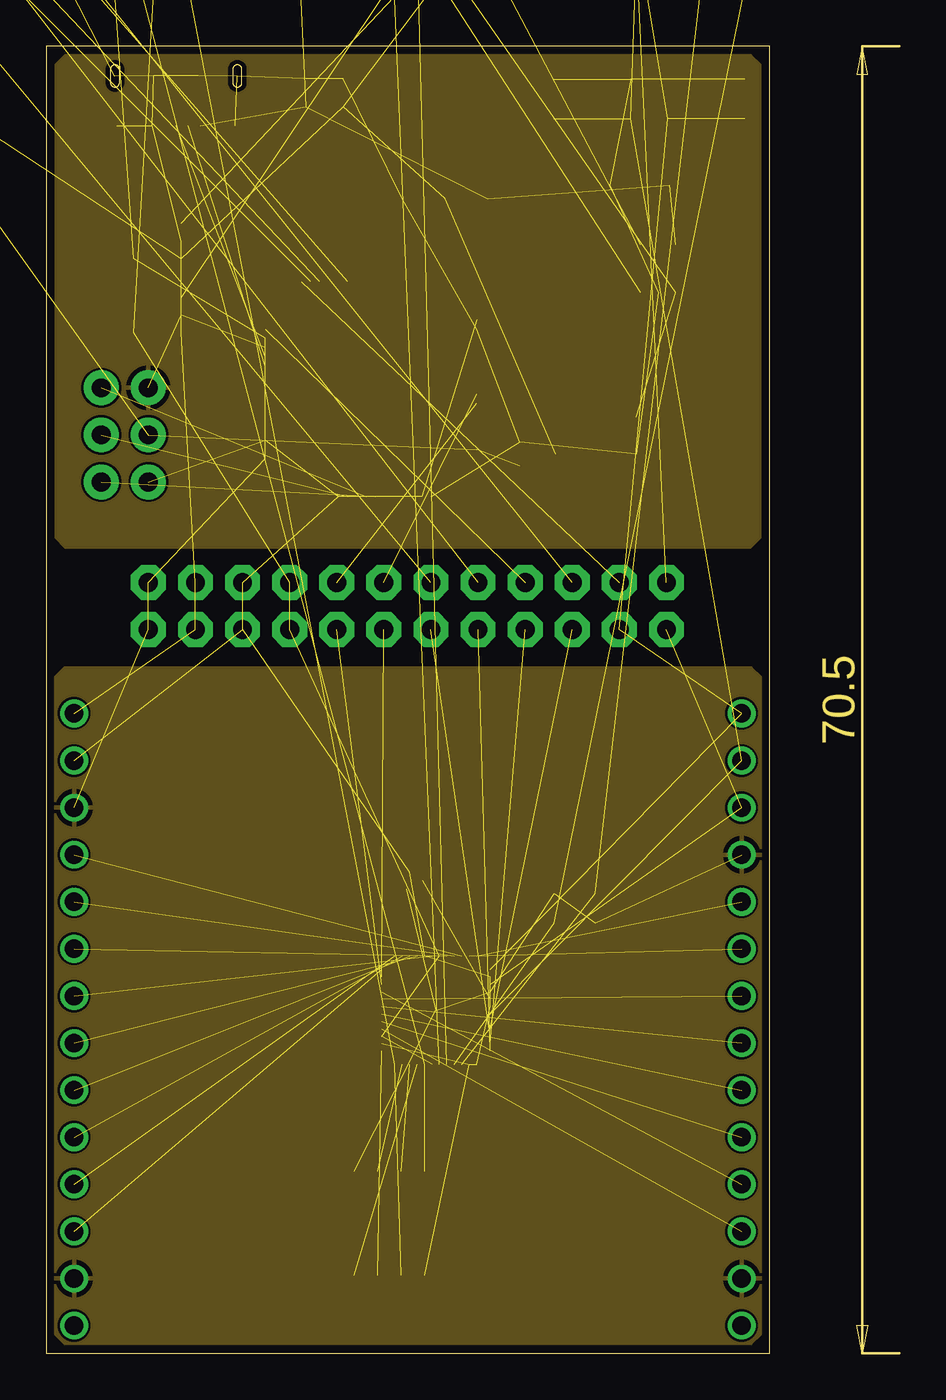
[diagram p6: board, inner layer GND]
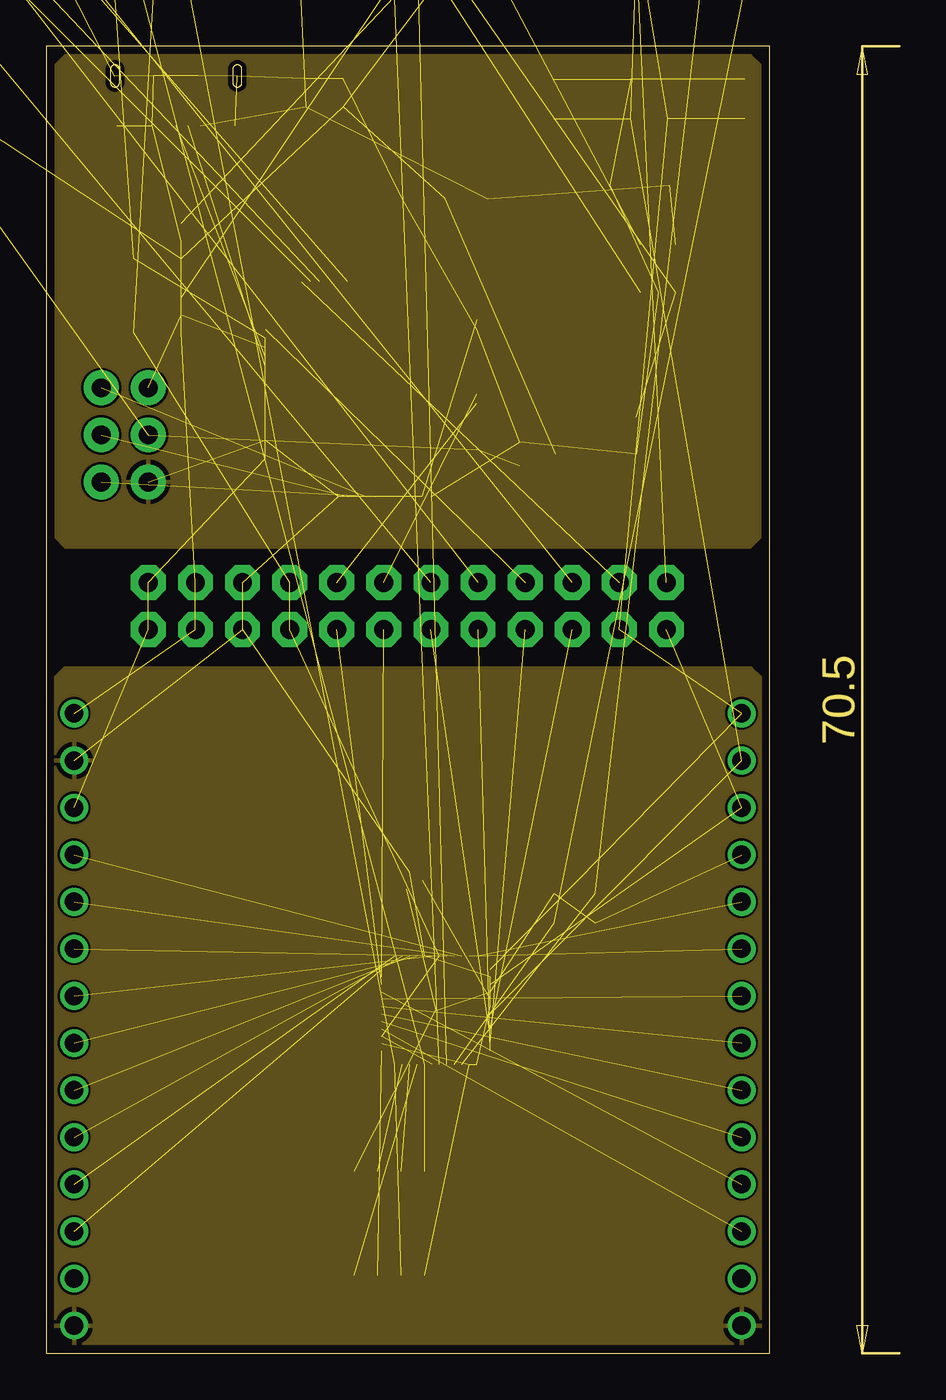
[diagram p7: board, inner layer 3.3V]
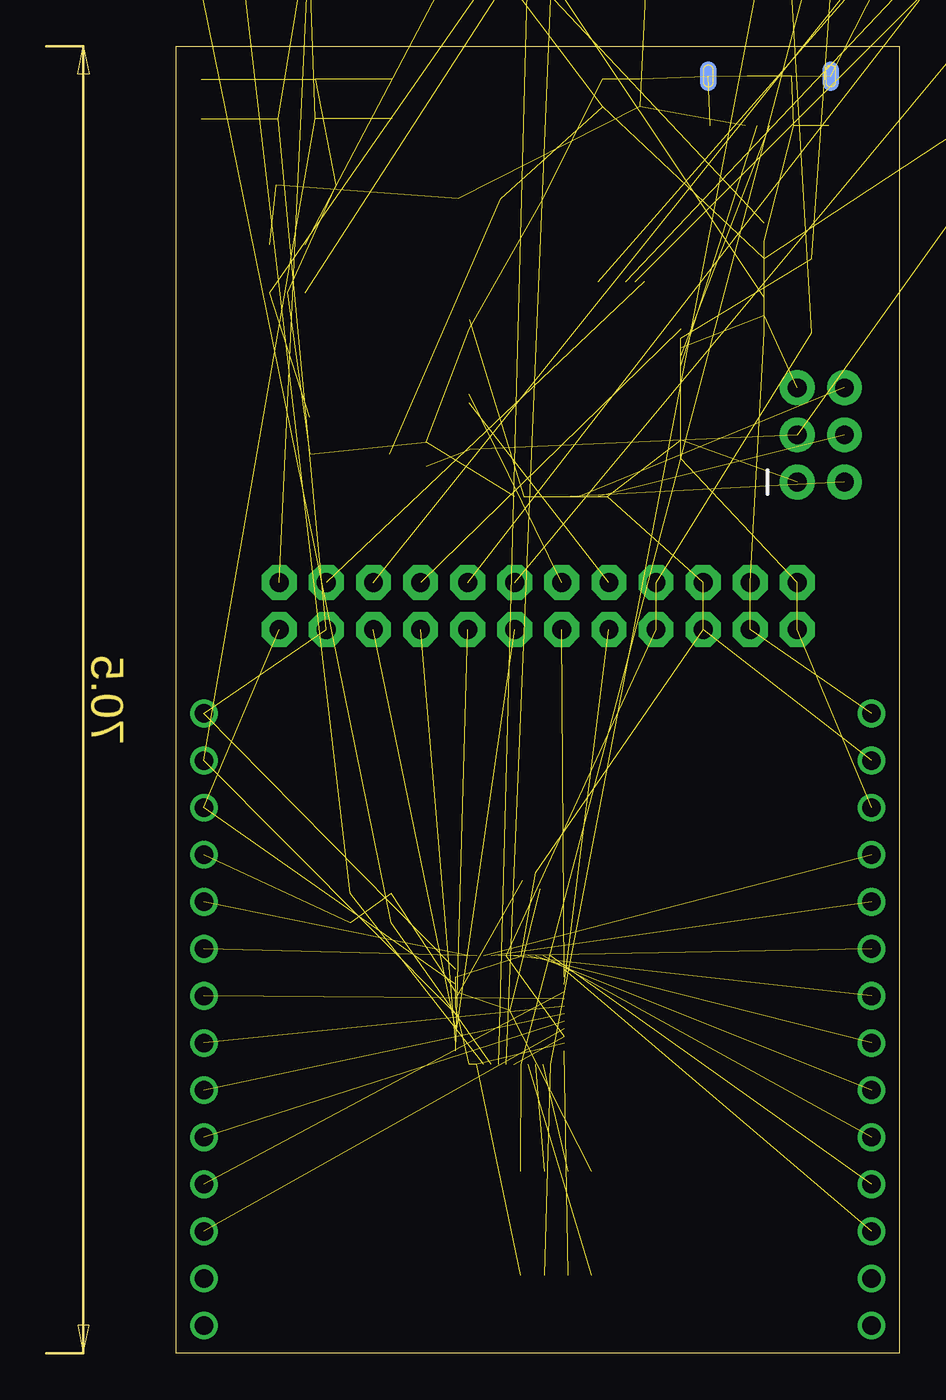
[diagram p8: board, bottom side, seen from below]

Size 39 x 70.5 mm. Coordinates in mm from the lower left corner, seen from the top.
Outline: 0,0 39,0 39,70.5 0,70.5 0,0
Copper layers (1+2*15+16): Top 0.035mm / dielectric 0.23mm / GND 0.035mm / dielectric 0.93mm / 3.3V 0.035mm / dielectric 0.23mm / Bottom 0.035mm
Design rules "MF_Standard_4_Layer *": minimum track width 5mil, minimum drill 10mil, track to track 5mil, track to pad 5mil, pad to pad 5mil, via to via 5mil, smd to smd 0mil, copper to edge 10mil, drill to drill 10mil, minimum pad ring 4mil, minimum via ring 4mil, stop-mask expansion 2mil, vias tented up to drill 25mil, thermal gap 10mil

### Footprints (pad centres in the part's own frame; a part is rotated, then mirrored left to right if it is on the bottom)
C0603 = smd 0.6 x 0.9: P$1 -0.75,0; P$2 0.75,0
SMFSERIES_LTF = smd 1.092 x 1.194: 1 -1.613,0; 2 1.613,0
LED0603 = smd 0.8 x 0.8: ANODE 0.75,0; CATHODE -0.75,0
SOD-123 = smd 1.4 x 1.4: A 1.85,0; C -1.85,0
SPARKFUN-DISCRETESEMI_0603 = smd 1.1 x 1: 1 -0.85,0; 2 0.85,0
SOD-523 = smd 0.8 x 0.6: A 0,-0.75; K 0,0.75
2X12 = drill 1.016 pad 1.88 octagon: 1 0,0; 2 0,2.54; 3 2.54,0; 4 2.54,2.54; 5 5.08,0; 6 5.08,2.54; 7 7.62,0; 8 7.62,2.54; 9 10.16,0; 10 10.16,2.54; 11 12.7,0; 12 12.7,2.54; 13 15.24,0; 14 15.24,2.54; 15 17.78,0; 16 17.78,2.54; 17 20.32,0; 18 20.32,2.54; 19 22.86,0; 20 22.86,2.54; 21 25.4,0; 22 25.4,2.54; 23 27.94,0; 24 27.94,2.54
MICROUSB-RIGHT = smd 0.4 x 1.35: 1 -1.3,1.27; 2 -0.65,1.27; 3 0,1.27; 4 0.65,1.27; 5 1.3,1.27 | smd 0.9 x 1.6: S1 -3.3,-1.4; S2 3.3,-1.4 | smd 1.6 x 1.4: S3 -3.2,1.27; S4 3.2,1.27 | smd 1.9 x 1.9: S5 -1.2,-1.405; S6 1.2,-1.405 | smd 0.9 x 1.6 bottom: S7 -3.3,-1.4; S8 3.3,-1.4
2X3 = drill 1.016 pad 1.88: 1 0,0; 2 0,2.54; 3 2.54,0; 4 2.54,2.54; 5 5.08,0; 6 5.08,2.54
PTH_2.54MM_01X14 = drill 1: P$1 -16.51,0; P$2 -13.97,0; P$3 -11.43,0; P$4 -8.89,0; P$5 -6.35,0; P$6 -3.81,0; P$7 -1.27,0; P$8 1.27,0; P$9 3.81,0; P$10 6.35,0; P$11 8.89,0; P$12 11.43,0; P$13 13.97,0; P$14 16.51,0
R0603 = smd 0.6 x 0.9: P$1 -0.75,0; P$2 0.75,0
TACT4.2MM = smd 1.05 x 0.65: P$1 -2.075,1.075; P$2 2.075,1.075; P$3 -2.075,-1.075; P$4 2.075,-1.075
SOT223-3_ONS = smd 0.61 x 1.549: 1 -2.299,-3.226; 2 0,-3.226; 3 2.299,-3.226
TSOT23-5_ONS = smd 0.953 x 0.508: 1 -1.276,0.95; 2 -1.276,0; 3 -1.276,-0.95; 4 1.276,-0.95; 5 1.276,0.95
SOT23-5 = smd 0.55 x 1.2: 1 -0.95,-1.3; 2 0,-1.3; 3 0.95,-1.3; 4 0.95,1.3; 5 -0.95,1.3
MCU_QFN-48-.4MMPITCH = smd 0.65 x 0.2: 1 -2.925,2.2; 2 -2.925,1.8; 3 -2.925,1.4; 4 -2.925,1; 5 -2.925,0.6; 6 -2.925,0.2; 7 -2.925,-0.2; 8 -2.925,-0.6; 9 -2.925,-1; 10 -2.925,-1.4; 11 -2.925,-1.8; 12 -2.925,-2.2; 25 2.925,-2.2; 26 2.925,-1.8; 27 2.925,-1.4; 28 2.925,-1; 29 2.925,-0.6; 30 2.925,-0.2; 31 2.925,0.2; 32 2.925,0.6; 33 2.925,1; 34 2.925,1.4; 35 2.925,1.8; 36 2.925,2.2 | smd 0.2 x 0.65: 13 -2.2,-2.925; 14 -1.8,-2.925; 15 -1.4,-2.925; 16 -1,-2.925; 17 -0.6,-2.925; 18 -0.2,-2.925; 19 0.2,-2.925; 20 0.6,-2.925; 21 1,-2.925; 22 1.4,-2.925; 23 1.8,-2.925; 24 2.2,-2.925; 37 2.2,2.925; 38 1.8,2.925; 39 1.4,2.925; 40 1,2.925; 41 0.6,2.925; 42 0.2,2.925; 43 -0.2,2.925; 44 -0.6,2.925; 45 -1,2.925; 46 -1.4,2.925; 47 -1.8,2.925; 48 -2.2,2.925 | smd 4.4 x 4.4: 49 0,0
IC-MEMORY_SO08 = smd 0.6 x 1.2: 1 -1.905,-2.8; 2 -0.635,-2.8; 3 0.635,-2.8; 4 1.905,-2.8; 5 1.905,2.8; 6 0.635,2.8; 7 -0.635,2.8; 8 -1.905,2.8
IC_USB_JTAG_LQFP-64 = smd 0.6 x 0.22: 1 -5.7,3.75; 2 -5.7,3.25; 3 -5.7,2.75; 4 -5.7,2.25; 5 -5.7,1.75; 6 -5.7,1.25; 7 -5.7,0.75; 8 -5.7,0.25; 9 -5.7,-0.25; 10 -5.7,-0.75; 11 -5.7,-1.25; 12 -5.7,-1.75; 13 -5.7,-2.25; 14 -5.7,-2.75; 15 -5.7,-3.25; 16 -5.7,-3.75; 33 5.7,-3.75; 34 5.7,-3.25; 35 5.7,-2.75; 36 5.7,-2.25; 37 5.7,-1.75; 38 5.7,-1.25; 39 5.7,-0.75; 40 5.7,-0.25; 41 5.7,0.25; 42 5.7,0.75; 43 5.7,1.25; 44 5.7,1.75; 45 5.7,2.25; 46 5.7,2.75; 47 5.7,3.25; 48 5.7,3.75 | smd 0.22 x 0.6: 17 -3.75,-5.8; 18 -3.25,-5.8; 19 -2.75,-5.8; 20 -2.25,-5.8; 21 -1.75,-5.8; 22 -1.25,-5.8; 23 -0.75,-5.8; 24 -0.25,-5.8; 25 0.25,-5.8; 26 0.75,-5.8; 27 1.25,-5.8; 28 1.75,-5.8; 29 2.25,-5.8; 30 2.75,-5.8; 31 3.25,-5.8; 32 3.75,-5.8; 49 3.75,5.8; 50 3.25,5.8; 51 2.75,5.8; 52 2.25,5.8; 53 1.75,5.8; 54 1.25,5.8; 55 0.75,5.8; 56 0.25,5.8; 57 -0.25,5.8; 58 -0.75,5.8; 59 -1.25,5.8; 60 -1.75,5.8; 61 -2.25,5.8; 62 -2.75,5.8; 63 -3.25,5.8; 64 -3.75,5.8
SC-70_C3_MCH = smd 0.457 x 1.168: 1 -0.65,-0.978; 2 0.65,-0.978; 3 0,0.978
JSTPH2 = smd 1 x 4.6: 1 -1,-3.7; 2 1,-3.7 | smd 1.6 x 3.4: NC1 -3.4,1.5; NC2 3.4,1.5
TSX-3225 = smd 1.4 x 1.15: 1 -1.1,-0.8; 2 1.1,-0.8; 3 1.1,0.8; 4 -1.1,0.8
XTAL4_SIT1533_SIT = smd 0.406 x 1.397: 1 -0.8,0; 3 0.8,0 | smd 0.305 x 0.508: 2 -0.099,-0.446; 4 0.106,0.446

### Placement (x,y rotation side)
C1  16,68 90 top
C2  14,68 90 top
C3  -20.4,80.28 0 top  (outside the outline)
C4  -24.21,80.28 0 top  (outside the outline)
C5  -28.02,80.28 0 top  (outside the outline)
C6  -31.83,80.28 0 top  (outside the outline)
C7  53.26,86.63 0 top  (outside the outline)
C8  49.45,86.63 0 top  (outside the outline)
C9  45.64,86.63 0 top  (outside the outline)
C10  41.83,86.63 0 top  (outside the outline)
C11  38.02,86.63 0 top  (outside the outline)
C12  34.21,86.63 0 top  (outside the outline)
C13  30.4,86.63 0 top  (outside the outline)
C14  26.59,86.63 0 top  (outside the outline)
C15  22.78,86.63 0 top  (outside the outline)
C16  18.97,86.63 0 top  (outside the outline)
C17  15.16,86.63 0 top  (outside the outline)
C18  11.35,86.63 0 top  (outside the outline)
C19  7.54,86.63 0 top  (outside the outline)
C20  3.73,86.63 0 top  (outside the outline)
C21  -0.08,86.63 0 top  (outside the outline)
C22  -3.89,86.63 0 top  (outside the outline)
C23  -7.7,86.63 0 top  (outside the outline)
C24  -11.51,86.63 0 top  (outside the outline)
C25  -15.32,86.63 0 top  (outside the outline)
C26  -19.13,86.63 0 top  (outside the outline)
C27  -22.94,86.63 0 top  (outside the outline)
C28  -26.75,86.63 0 top  (outside the outline)
C29  -30.56,86.63 0 top  (outside the outline)
C30  53.26,90.44 0 top  (outside the outline)
C31  49.45,90.44 0 top  (outside the outline)
C32  45.64,90.44 0 top  (outside the outline)
C33  41.83,90.44 0 top  (outside the outline)
C34  38.02,90.44 0 top  (outside the outline)
D1  32,63 180 top
D2  2.46,80.28 0 top  (outside the outline)
D3  -1.35,80.28 0 top  (outside the outline)
D4  -5.16,80.28 0 top  (outside the outline)
D5  -8.97,80.28 0 top  (outside the outline)
D6  15.16,81.55 0 top  (outside the outline)
D7  31.67,95.52 0 top  (outside the outline)
D8  27.86,95.52 0 top  (outside the outline)
D9  21.51,94.25 0 top  (outside the outline)
J1-NEST-OWL1  5.5,39.04 0 top
J2-USB  7,67.5 180 top
J3-MK22-DBG  5.5,47 90 top
J4  1.5,18 270 top
J5  37.5,18 270 top
R1  34.21,90.44 0 top  (outside the outline)
R2  30.4,90.44 0 top  (outside the outline)
R3  26.59,90.44 0 top  (outside the outline)
R4  22.78,90.44 0 top  (outside the outline)
R5  18.97,90.44 0 top  (outside the outline)
R6  15.16,90.44 0 top  (outside the outline)
R7  11.35,90.44 0 top  (outside the outline)
R8  7.54,90.44 0 top  (outside the outline)
R9  3.73,90.44 0 top  (outside the outline)
R10  -0.08,90.44 0 top  (outside the outline)
R11  -3.89,90.44 0 top  (outside the outline)
R12  -7.7,90.44 0 top  (outside the outline)
R13  -11.51,90.44 0 top  (outside the outline)
R14  -15.32,90.44 0 top  (outside the outline)
R15  -19.13,90.44 0 top  (outside the outline)
R16  -22.94,90.44 0 top  (outside the outline)
R17  -26.75,90.44 0 top  (outside the outline)
SW1  29.43,67.66 0 top
SW2  35.58,67.66 0 top
U1  21.5,65.5 0 top
U2  6,60 180 top
U3  6,56 180 top
U4  33,58.5 0 top
U5  21,18.5 90 top
U6  18.5,7 180 top
U7  17.5,52 0 top
U8  26.5,48.5 270 top
X1  35.5,49.5 270 top
Y1  28.5,24 0 top
Y2  19.5,25.5 0 top

### Tracks (layer width: path | path; a pad name or v marks a point on that pad's centre or on a via)
1.8V  (11 unrouted)
3.3V  (44 unrouted)
  pour 3.3V: 0.5,36.5 1,37 38,37 38.5,36.5 38.5,1 38,0.5 1,0.5 0.5,1
  pour 3.3V: 0.5,44 1,43.5 38,43.5 38.5,44 38.5,69.5 38,70 1,70 0.5,69.5
5V  (11 unrouted)
16MHZ_IN  (3 unrouted)
16MHZ_OUT  (3 unrouted)
32KHZ_CLK  (1 unrouted)
CORE_EN_NEST  (2 unrouted)
CS0  (1 unrouted)
CS2  (1 unrouted)
CS3  (1 unrouted)
DBG_RESET  (3 unrouted)
DBG_SWDCLK  (1 unrouted)
DBG_SWDIO  (1 unrouted)
DBG_SWO  (1 unrouted)
GND  (70 unrouted)
  pour GND: 0.5,36.5 1,37 38,37 38.5,36.5 38.5,1 38,0.5 1,0.5 0.5,1
  pour GND: 0.5,44 1,43.5 38,43.5 38.5,44 38.5,69.5 38,70 1,70 0.5,69.5
IO11  (1 unrouted)
IO19  (1 unrouted)
IO20  (1 unrouted)
IO21  (1 unrouted)
IO22  (1 unrouted)
JTAG_TCK  (1 unrouted)
JTAG_TCK_NEST  (1 unrouted)
JTAG_TDI  (1 unrouted)
JTAG_TDI_NEST  (1 unrouted)
JTAG_TDO  (1 unrouted)
JTAG_TDO_NEST  (1 unrouted)
JTAG_TMS  (1 unrouted)
JTAG_TMS_NEST  (1 unrouted)
MISO  (1 unrouted)
MOSI  (1 unrouted)
N$1  (1 unrouted)
N$2  (1 unrouted)
N$3  (1 unrouted)
N$4  (2 unrouted)
N$5  (1 unrouted)
N$6  (1 unrouted)
N$7  (1 unrouted)
N$8  (1 unrouted)
N$10  (2 unrouted)
N$12  (1 unrouted)
N$14  (1 unrouted)
N$16  (1 unrouted)
PLL_AVDD  (3 unrouted)
PWM0_0  (1 unrouted)
PWM0_1  (1 unrouted)
QSPI_CS  (2 unrouted)
QSPI_DQ0  (1 unrouted)
QSPI_DQ1  (1 unrouted)
QSPI_DQ2  (1 unrouted)
QSPI_DQ3  (2 unrouted)
QSPI_SCK  (1 unrouted)
RESET  (8 unrouted)
RESET_NEST  (1 unrouted)
RXI  (1 unrouted)
SCK  (1 unrouted)
SCL  (1 unrouted)
SDA  (1 unrouted)
TXO  (1 unrouted)
UART_RX  (1 unrouted)
UART_RX_NEST  (1 unrouted)
UART_TX  (1 unrouted)
UART_TX_NEST  (1 unrouted)
USB_N  (1 unrouted)
USB_P  (1 unrouted)
V_BATT  (3 unrouted)
V_USB  (7 unrouted)
VDD_CORE_EN  (2 unrouted)
WAKE  (5 unrouted)